# EAGLE design Board_v1_4 (EAGLE 9.6.2)
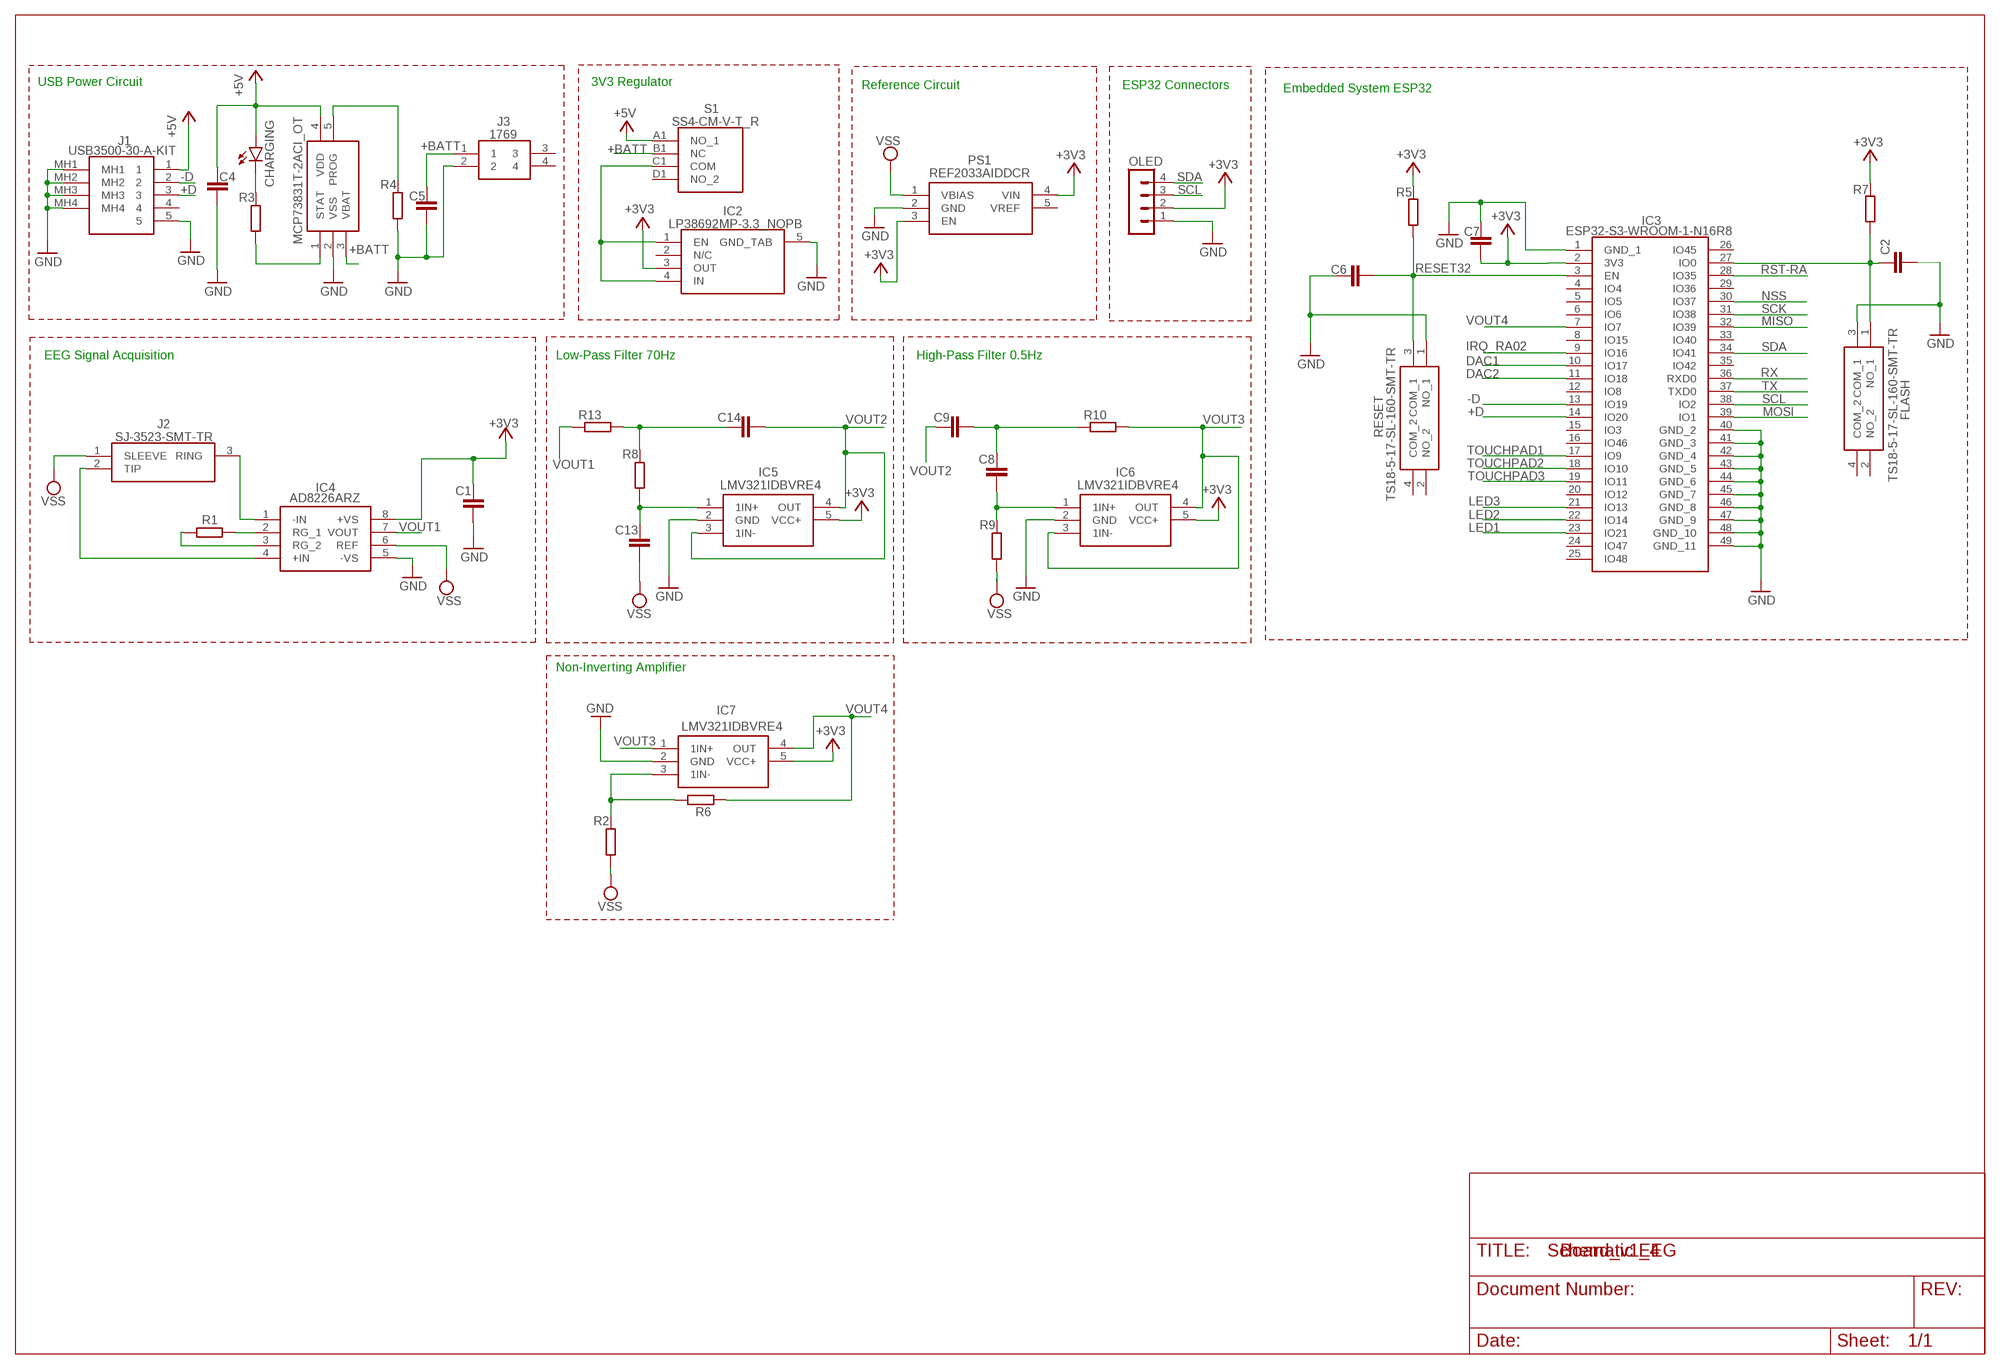
[diagram p0: schematic, sheet 1]

## Parts
C1  C-EUC0805  [C0805]
C2  C-EUC0805  [C0805]
C4  C-EUC0805  [C0805]
C5  C-EUC0805  [C0805]
C6  C-EUC0805  [C0805]
C7  C-EUC0805  [C0805]
C8  C-EUC0805  [C0805]
C9  C-EUC0805  [C0805]
C13  C-EUC0805  [C0805]
C14  C-EUC0805  [C0805]
CHARGING  LEDCHIP-LED0805  [CHIP-LED0805]
FLASH  TS18-5-17-SL-160-SMT-TR  [TS18517SL160SMTTR]
IC1  MCP73831T-2ACI_OT  [SOT95P270X145-5N]
IC2  LP38692MP-3.3_NOPB  [SOT150P700X180-5N]
IC3  ESP32-S3-WROOM-1-N16R8  [ESP32S3WROOM1N16R8]
IC4  AD8226ARZ  [SOIC127P600X175-8N]
IC5  LMV321IDBVRE4  [SOT95P280X145-5N]
IC6  LMV321IDBVRE4  [SOT95P280X145-5N]
IC7  LMV321IDBVRE4  [SOT95P280X145-5N]
J1  USB3500-30-A-KIT  [USB350030AKIT]
J2  SJ-3523-SMT-TR  [SJ3523SMTTR]
J3  1769  [1769]
OLED  MA04-1  [MA04-1]
PS1  REF2033AIDDCR  [SOT95P280X110-5N]
R1  R-EU_R0805  [R0805]
R2  R-EU_R0805  [R0805]
R3  220  R-EU_R0805  [R0805]
R4  R-EU_R0805  [R0805]
R5  R-EU_R0805  [R0805]
R6  R-EU_R0805  [R0805]
R7  R-EU_R0805  [R0805]
R8  R-EU_R0805  [R0805]
R9  R-EU_R0805  [R0805]
R10  R-EU_R0805  [R0805]
R13  R-EU_R0805  [R0805]
RESET  TS18-5-17-SL-160-SMT-TR  [TS18517SL160SMTTR]
S1  SS4-CM-V-T_R  [SS4CMVTR]

## Nets
+3V3: C1.1 C7.2 IC2.3(OUT) IC3.2(3V3) IC4.8(+VS) IC5.5(VCC+) IC6.5(VCC+) IC7.5(VCC+) OLED.2 PS1.3(EN) PS1.4(VIN) R5.2 R7.2
+5V: J1.1 S1.A1(NO_1)
+BATT: C5.2 IC1.3(VBAT) J3.1 S1.B1(NC)
+D: IC3.14(IO20) J1.3
-D: IC3.13(IO19) J1.2
DAC1: IC3.10(IO17)
DAC2: IC3.11(IO18)
GND: C1.2 C2.2 C4.1 C5.1 C6.1 C7.1 FLASH.3(COM_1) IC1.2(VSS) IC2.5(GND_TAB) IC3.1(GND_1) IC3.40(GND_2) IC3.41(GND_3) IC3.42(GND_4) IC3.43(GND_5) IC3.44(GND_6) IC3.45(GND_7) IC3.46(GND_8) IC3.47(GND_9) IC3.48(GND_10) IC3.49(GND_11) IC4.5(-VS) IC5.2(GND) IC6.2(GND) IC7.2(GND) J1.5 J1.MH1 J1.MH2 J1.MH3 J1.MH4 J3.2 OLED.1 PS1.2(GND) R4.1 RESET.1(NO_1)
IRQ_RA02: IC3.9(IO16)
LED1: IC3.23(IO21)
LED2: IC3.22(IO14)
LED3: IC3.21(IO13)
MISO: IC3.32(IO39)
MOSI: IC3.39(IO1)
N$1: IC4.2(RG_1) R1.2
N$2: IC4.3(RG_2) R1.1
N$3: IC4.1(-IN) J2.3(RING)
N$4: IC4.4(+IN) J2.2(TIP)
N$5: C8.2 IC6.1(1IN+) R9.2
N$6: IC1.1(STAT) R3.1
N$7: IC1.5(PROG) R4.2
N$8: CHARGING.C R3.2
N$9: C8.1 C9.2 R10.1
N$10: C2.1 FLASH.1(NO_1) IC3.27(IO0) R7.1
N$11: C13.1 IC5.1(1IN+) R8.1
N$13: IC2.1(EN) IC2.4(IN) S1.C1(COM)
N$14: IC7.3(1IN-) R2.2 R6.2
N$15: C4.2 CHARGING.A IC1.4(VDD)
N$17: C14.1 R8.2 R13.2
NSS: IC3.30(IO37)
RESET32: C6.2 IC3.3(EN) R5.1 RESET.3(COM_1)
RST-RA: IC3.28(IO35)
RX: IC3.36(RXD0)
SCK: IC3.31(IO38)
SCL: IC3.38(IO2) OLED.3
SDA: IC3.34(IO41) OLED.4
TOUCHPAD1: IC3.17(IO9)
TOUCHPAD2: IC3.18(IO10)
TOUCHPAD3: IC3.19(IO11)
TX: IC3.37(TXD0)
VOUT1: IC4.7(VOUT) R13.1
VOUT2: C9.1 C14.2 IC5.3(1IN-) IC5.4(OUT)
VOUT3: IC6.3(1IN-) IC6.4(OUT) IC7.1(1IN+) R10.2
VOUT4: IC3.7(IO7) IC7.4(OUT) R6.1
VSS: C13.2 IC4.6(REF) J2.1(SLEEVE) PS1.1(VBIAS) R2.1 R9.1
Unconnected: FLASH.2(NO_2) FLASH.4(COM_2) IC2.2(N/C) IC3.4(IO4) IC3.5(IO5) IC3.6(IO6) IC3.8(IO15) IC3.12(IO8) IC3.15(IO3) IC3.16(IO46) IC3.20(IO12) IC3.24(IO47) IC3.25(IO48) IC3.26(IO45) IC3.29(IO36) IC3.33(IO40) IC3.35(IO42) J1.4 J3.3 J3.4 PS1.5(VREF) RESET.2(NO_2) RESET.4(COM_2) S1.D1(NO_2)

## Notes on the sheet
- USB Power Circuit | 3V3 Regulator | Reference Circuit | ESP32 Connectors
- Embedded System ESP32
- EEG Signal Acquisition | Low-Pass Filter 70Hz | High-Pass Filter 0.5Hz
- Non-Inverting Amplifier
- Schematic EEG

## Library data of the parts
C1 C2 C4-C9 C13 C14 = rcl:C-EU: CAPACITOR, European symbol; SPICEPREFIX: C
CHARGING = led:LED: LED OSRAM: - CHIPLED LG R971, LG N971, LY N971, LG Q971, LY Q971, LO R971, LY R971 LH N974, LH R974 LS Q976, LO Q976, LY Q976 LO Q996 - Hyper CHIPLED LW Q18S LB Q993, LB Q99A, LB R99A - SideLED LS A670, LO A670, LY A670, LG A670, LP A670 LB A673, LV A673, LT A673, LW A673 LH A674 LY A675 LS A676, LA A676, LO A676, LY A676, LW A676 LS A679, LY A679, LG A679 - Hyper Micro SIDELED® LS Y876, LA Y876, LO Y876, LY Y876 LT Y87S - SmartLED LW L88C, LW L88S LB L89C, LB L89S, LG L890 LS L89K, LO L89K, LY L89K LS L896, LA L896, LO L896, LY L896 - TOPLED LS T670, LO T670, LY T670, LG T670, LP T670 LSG T670, LSP T670, LSY T670, LOP T670, LYG T670 LG T671, LOG T671, LSG T671 LB T673, LV T673, LT T673, LW T673 LH T674 LS T676, LA T676, LO T676, LY T676, LB T676, LH T676, LSB T676, LW T676 LB T67C, LV T67C, LT T67C, LS T67K, LO T67K, LY T67K, LW E67C LS E67B, LA E67B, LO E67B, LY E67B, LB E67C, LV E67C, LT E67C LW T67C LS T679, LY T679, LG T679 LS T770, LO T770, LY T770, LG T770, LP T770 LB T773, LV T773, LT T773, LW T773 LH T774 LS E675, LA E675, LY E675, LS T675 LS T776, LA T776, LO T776, LY T776, LB T776 LHGB T686 LT T68C, LB T68C - Hyper Mini TOPLED® LB M676 - Mini TOPLED Santana® LG M470 LS M47K, LO M47K, LY M47K Source: http://www.osram.convergy.de LUXEON: - LUMILED® LXK2-PW12-R00, LXK2-PW12-S00, LXK2-PW14-U00, LXK2-PW14-V00 LXK2-PM12-R00, LXK2-PM12-S00, LXK2-PM14-U00 LXK2-PE12-Q00, LXK2-PE12-R00, LXK2-PE12-S00, LXK2-PE14-T00, LXK2-PE14-U00 LXK2-PB12-K00, LXK2-PB12-L00, LXK2-PB12-M00, LXK2-PB14-N00, LXK2-PB14-P00, LXK2-PB14-Q00 LXK2-PR12-L00, LXK2-PR12-M00, LXK2-PR14-Q00, LXK2-PR14-R00 LXK2-PD12-Q00, LXK2-PD12-R00, LXK2-PD12-S00 LXK2-PH12-R00, LXK2-PH12-S00 LXK2-PL12-P00, LXK2-PL12-Q00, LXK2-PL12-R00 Source: www.luxeon.com KINGBRIGHT: KA-3528ASYC Source: www.kingbright.com
FLASH RESET = TS18-5-17-SL-160-SMT-TR:TS18-5-17-SL-160-SMT-TR: 5 x 5 mm, 1.7 mm Actuator Height, 160 gf, Silver, Surface Mount, TR, SPST, Tactile Switch Source: Datasheet <https://www.sameskydevices.com/product/resource/supplyframepdf/ts18.pdf>; DESCRIPTION: 5 x 5 mm, 1.7 mm Actuator Height, 160 gf, Silver, Surface Mount, TR, SPST, Tactile Switch; HEIGHT: 1.8mm; MANUFACTURER_NAME: Same Sky; MANUFACTURER_PART_NUMBER: TS18-5-17-SL-160-SMT-TR; MOUSER_PART_NUMBER: 179-TS18517SL160SMTT; MOUSER_PRICE-STOCK: https://www.mouser.co.uk/ProductDetail/CUI-Devices/TS18-5-17-SL-160-SMT-TR?qs=tlsG%2FOw5FFhWy38y3t272A%3D%3D
IC1 = MCP73831T-2ACI_OT:MCP73831T-2ACI_OT: Li-Ion Charge Controller 4.2V SOT23-5 Source: Datasheet <http://ww1.microchip.com/downloads/en/DeviceDoc/20001984g.pdf>; ARROW_PART_NUMBER: MCP73831T-2ACI/OT; ARROW_PRICE-STOCK: https://www.arrow.com/en/products/mcp73831t-2aciot/microchip-technology?utm_currency=USD&region=nac; DESCRIPTION: Li-Ion Charge Controller 4.2V SOT23-5; HEIGHT: 1.45mm; MANUFACTURER_NAME: Microchip; MANUFACTURER_PART_NUMBER: MCP73831T-2ACI/OT; MOUSER_PART_NUMBER: 579-MCP73831T-2ACIOT; MOUSER_PRICE-STOCK: https://www.mouser.co.uk/ProductDetail/Microchip-Technology/MCP73831T-2ACI-OT?qs=yUQqVecv4qvbBQBGbHx0Mw%3D%3D
IC2 = LP38692MP-3.3_NOPB:LP38692MP-3.3_NOPB: LP38692MP-3.3/NOPB, Low Dropout Voltage Regulator, 1A, 3.3 V +/-2.5%, 2.7 10 Vin, 5-Pin SOT-223 Source: Datasheet <http://www.ti.com/lit/ds/symlink/lp38692.pdf>; DESCRIPTION: LP38692MP-3.3/NOPB, Low Dropout Voltage Regulator, 1A, 3.3 V +/-2.5%, 2.7 10 Vin, 5-Pin SOT-223; HEIGHT: 1.8mm; MANUFACTURER_NAME: Texas Instruments; MANUFACTURER_PART_NUMBER: LP38692MP-3.3/NOPB; MOUSER_PART_NUMBER: 926-LP38692MP3.3NOPB; MOUSER_PRICE-STOCK: https://www.mouser.co.uk/ProductDetail/Texas-Instruments/LP38692MP-3.3-NOPB?qs=1FNqv8aZn1TpKuOP2NKBdg%3D%3D
IC3 = ESP32-S3-WROOM-1-N16R8:ESP32-S3-WROOM-1-N16R8: Multiprotocol Modules SMD Module, ESP32-S3R8, 3.3V, 8 MB Octal PSRAM Die, 16 MB Quad SPI Flash, PCB Antenna Source: Datasheet <https://www.espressif.com/sites/default/files/documentation/esp32-s3-wroom-1_wroom-1u_datasheet_en.pdf>; DESCRIPTION: Multiprotocol Modules SMD Module, ESP32-S3R8, 3.3V, 8 MB Octal PSRAM Die, 16 MB Quad SPI Flash, PCB Antenna; HEIGHT: 3.25mm; MANUFACTURER_NAME: Espressif Systems; MANUFACTURER_PART_NUMBER: ESP32-S3-WROOM-1-N16R8; MOUSER_PART_NUMBER: 356-ESP32S3WRM1N16R8; MOUSER_PRICE-STOCK: https://www.mouser.co.uk/ProductDetail/Espressif-Systems/ESP32-S3-WROOM-1-N16R8?qs=Li%252BoUPsLEnvQc9gW6AMhZg%3D%3D
IC4 = AD8226ARZ:AD8226ARZ: Wide Supply Range, Rail-to-Rail Output Instrumentation Amplifier Source: Datasheet <http://componentsearchengine.com/Datasheets/3/AD8226ARZ.pdf>; DESCRIPTION: Wide Supply Range, Rail-to-Rail Output Instrumentation Amplifier; HEIGHT: 1.75mm; MANUFACTURER_NAME: Analog Devices; MANUFACTURER_PART_NUMBER: AD8226ARZ; MOUSER_PART_NUMBER: 584-AD8226ARZ; MOUSER_PRICE-STOCK: https://www.mouser.co.uk/ProductDetail/Analog-Devices/AD8226ARZ?qs=%2FtpEQrCGXCzihJADRPlhCg%3D%3D
IC5-IC7 = LMV321IDBVRE4:LMV321IDBVRE4: OP Amp Single GP R-R O/P 5.5V 5-Pin SOT-23 T/R Source: Datasheet <https://www.ti.com/lit/ds/symlink/lmv321.pdf?ts=1639294341048&ref_url=https%3A%2F%2Fwww.ti.com%2Fstore%2Fti%2Fen%2Fp%2Fproduct%2F%3Fp%3DLMV321IDBVR>; DESCRIPTION: OP Amp Single GP R-R O/P 5.5V 5-Pin SOT-23 T/R; HEIGHT: 1.45mm; MANUFACTURER_NAME: Texas Instruments; MANUFACTURER_PART_NUMBER: LMV321IDBVRE4; MOUSER_PART_NUMBER: 595-LMV321IDBVRE4; MOUSER_PRICE-STOCK: https://www.mouser.co.uk/ProductDetail/Texas-Instruments/LMV321IDBVRE4?qs=yhNIDeTE%252BcaI6cu5FHph6A%3D%3D
J1 = USB3500-30-A-KIT:USB3500-30-A-KIT: USB Connectors Micro B Skt, Mid Mount-SMT, R/A, 30u", With Peg, T&R, IP67 + USBTJ-02 Gasket Source: Datasheet <https://gct.co/files/drawings/usb3500.pdf>; DESCRIPTION: USB Connectors Micro B Skt, Mid Mount-SMT, R/A, 30u", With Peg, T&R, IP67 + USBTJ-02 Gasket; HEIGHT: 2.8mm; MANUFACTURER_NAME: GCT (GLOBAL CONNECTOR TECHNOLOGY); MANUFACTURER_PART_NUMBER: USB3500-30-A-KIT; MOUSER_PART_NUMBER: 640-USB3500-30-A-KIT; MOUSER_PRICE-STOCK: https://www.mouser.co.uk/ProductDetail/GCT/USB3500-30-A-KIT?qs=KUoIvG%2F9IlZmD2kH2DfgYg%3D%3D
J2 = SJ-3523-SMT-TR:SJ-3523-SMT-TR: 3.5 mm, Stereo, Right Angle, Surface Mount (SMT), 3 Conductors, 0 Internal Switches, Audio Jack Connector Source: Datasheet <https://www.sameskydevices.com/product/resource/supplyframepdf/sj-352x-smt.pdf>; DESCRIPTION: 3.5 mm, Stereo, Right Angle, Surface Mount (SMT), 3 Conductors, 0 Internal Switches, Audio Jack Connector; HEIGHT: 5.2mm; MANUFACTURER_NAME: Same Sky; MANUFACTURER_PART_NUMBER: SJ-3523-SMT-TR; MOUSER_PART_NUMBER: 490-SJ-3523-SMT-TR; MOUSER_PRICE-STOCK: https://www.mouser.co.uk/ProductDetail/CUI-Devices/SJ-3523-SMT-TR?qs=WyjlAZoYn51zOHzJ3r4ZRA%3D%3D
J3 = 1769:1769: Adafruit Accessories JST-PH 2-pin SMT Right Angle Connect Source: Datasheet <https://cdn-shop.adafruit.com/datasheets/17311.pdf>; ARROW_PART_NUMBER: 1769; ARROW_PRICE-STOCK: https://www.arrow.com/en/products/1769/adafruit-industries?utm_currency=USD&region=nac; DESCRIPTION: Adafruit Accessories JST-PH 2-pin SMT Right Angle Connect; HEIGHT: 5.5mm; MANUFACTURER_NAME: Adafruit; MANUFACTURER_PART_NUMBER: 1769; MOUSER_PART_NUMBER: 485-1769; MOUSER_PRICE-STOCK: https://www.mouser.co.uk/ProductDetail/Adafruit/1769?qs=GURawfaeGuBbgoGtf2XstA%3D%3D
OLED = con-lstb:MA04-1: PIN HEADER; OC_FARNELL: unknown; OC_NEWARK: unknown
PS1 = REF2033AIDDCR:REF2033AIDDCR: Low-Drift, Low-Power, Dual-Output Vref and Vref/2 Voltage Reference Source: Datasheet <http://www.ti.com/lit/ds/symlink/ref2033.pdf>; DESCRIPTION: Low-Drift, Low-Power, Dual-Output Vref and Vref/2 Voltage Reference; HEIGHT: 1.1mm; MANUFACTURER_NAME: Texas Instruments; MANUFACTURER_PART_NUMBER: REF2033AIDDCR; MOUSER_PART_NUMBER: 595-REF2033AIDDCR; MOUSER_PRICE-STOCK: https://www.mouser.co.uk/ProductDetail/Texas-Instruments/REF2033AIDDCR?qs=7z%252BmIopC6%2FKHHOBVNaL7UQ%3D%3D
R1-R10 R13 = rcl:R-EU_: RESISTOR, European symbol; SPICEPREFIX: R
S1 = SS4-CM-V-T_R:SS4-CM-V-T_R: Slide Switches Slide Type 1P3T (2.0mm height) Source: Datasheet <https://componentsearchengine.com/Datasheets/1/SS4-CM-V-T_R.pdf>; DESCRIPTION: Slide Switches Slide Type 1P3T (2.0mm height); HEIGHT: 2mm; MANUFACTURER_NAME: Diptronics; MANUFACTURER_PART_NUMBER: SS4-CM-V-T/R; MOUSER_PART_NUMBER: 113-SS4CMVTR; MOUSER_PRICE-STOCK: https://www.mouser.co.uk/ProductDetail/Diptronics/SS4-CM-V-T-R?qs=MLItCLRbWswqNEU%2F6grMKg%3D%3D

## Board
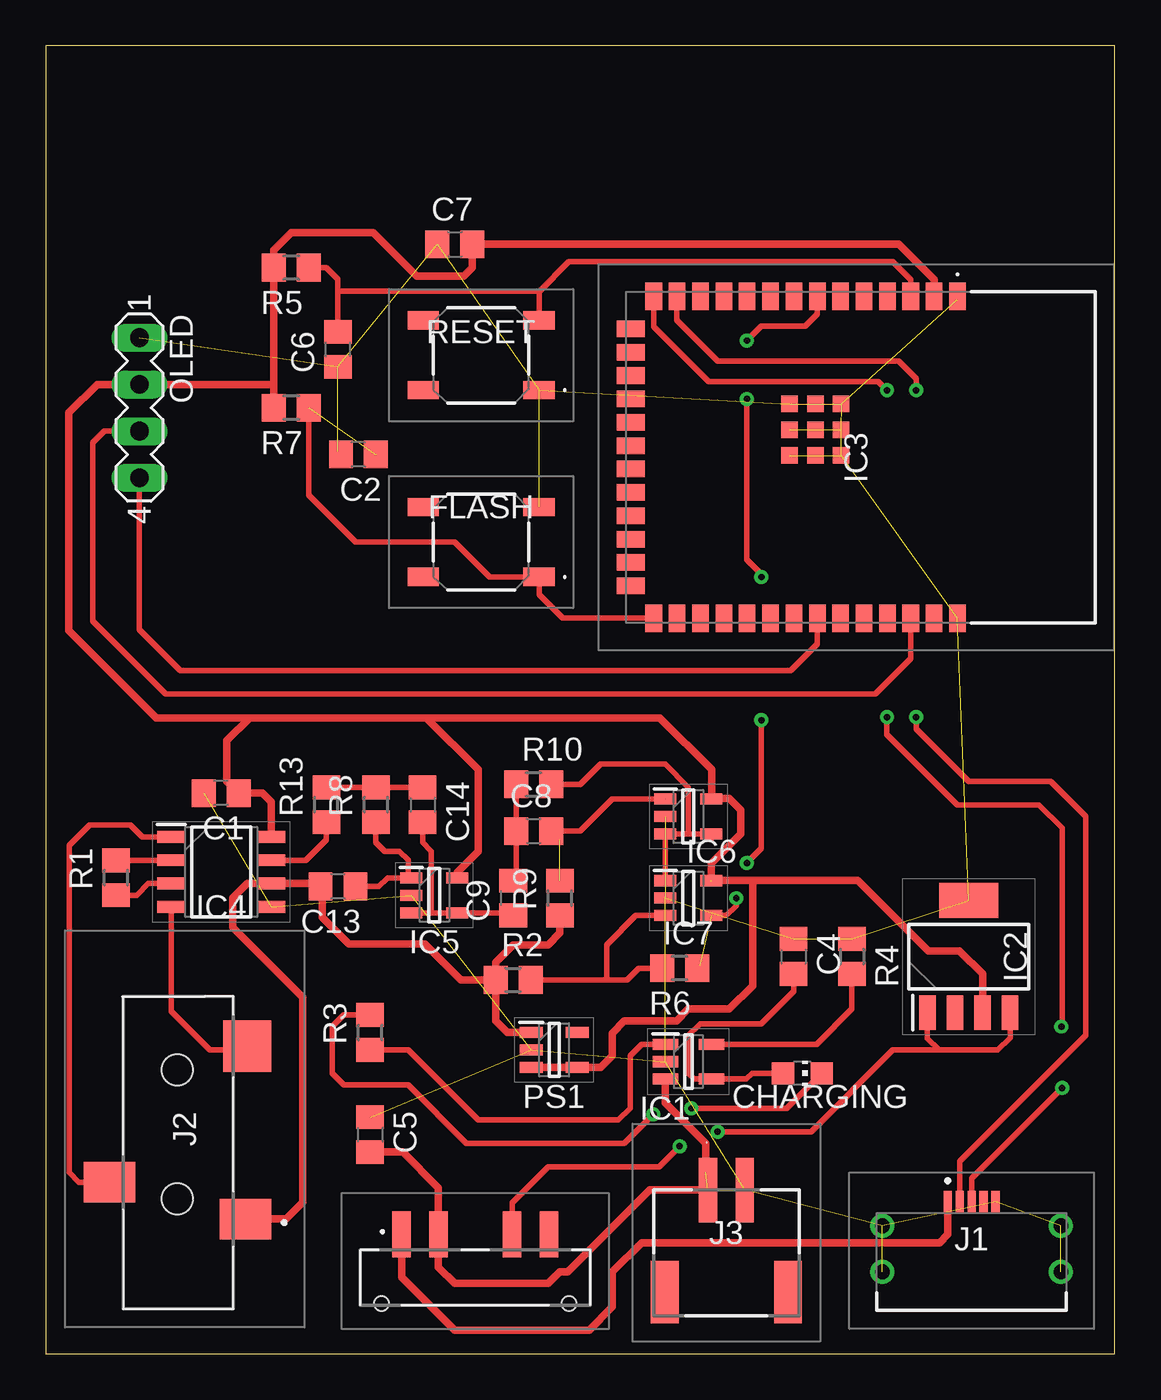
[diagram p1: board, top side]
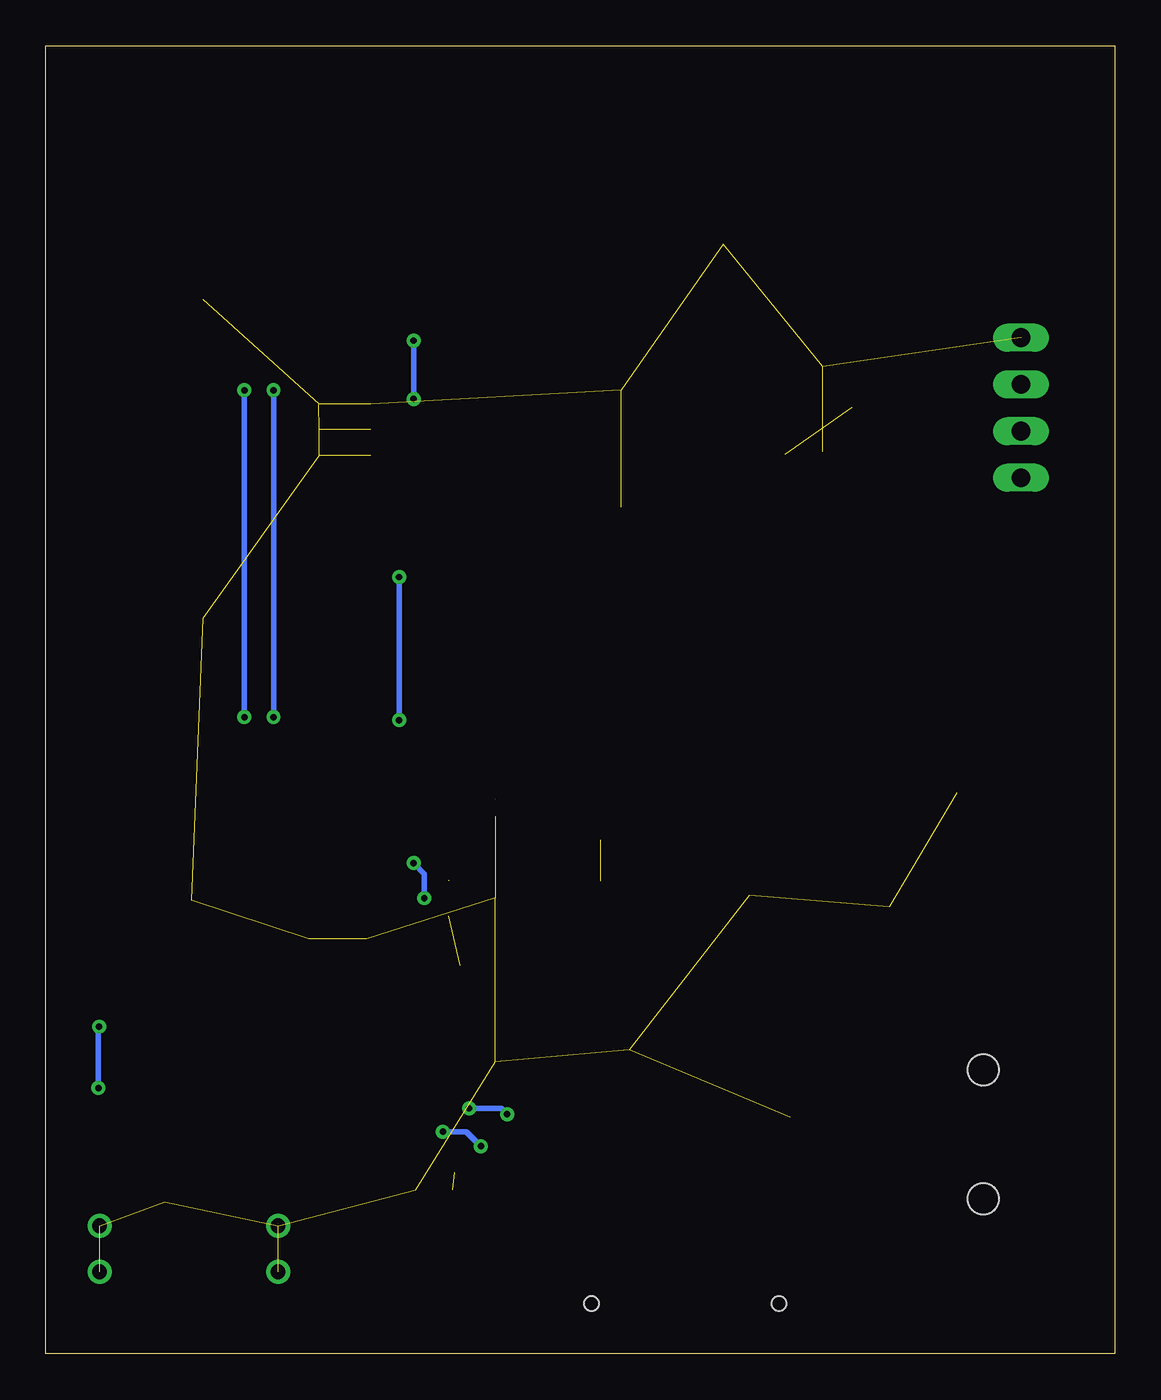
[diagram p2: board, bottom side, seen from below]

Size 58.09 x 71.11 mm. Coordinates in mm from the lower left corner, seen from the top.
Outline: 0,0 58.09,0 58.09,71.11 0,71.11 0,0
Copper layers (1*16): Top 0.035mm / dielectric 1.5mm / Bottom 0.035mm
Design rules "default": minimum track width 6mil, minimum drill 0.35mm, track to track 6mil, track to pad 6mil, pad to pad 6mil, via to via 6mil, smd to smd 6mil, copper to edge 40mil, drill to drill 6mil, minimum pad ring 10mil, minimum via ring 8mil, stop-mask expansion 4mil, vias tented up to drill 0mil, thermal gap 10mil

### Footprints (pad centres in the part's own frame; a part is rotated, then mirrored left to right if it is on the bottom)
C0805 = smd 1.3 x 1.5: 1 -0.95,0; 2 0.95,0
CHIP-LED0805 = smd 1.2 x 1.2: A 0,-1.05; C 0,1.05
TS18517SL160SMTTR = smd 1.7 x 1: 1 -3.15,1.9; 2 3.15,1.9; 3 -3.15,-1.9; 4 3.15,-1.9
SOT95P270X145-5N = smd 1.4 x 0.6: 1 -1.25,0.95; 2 -1.25,0; 3 -1.25,-0.95; 4 1.25,-0.95; 5 1.25,0.95
SOT150P700X180-5N = smd 1.9 x 0.9: 1 -3.05,2.25; 2 -3.05,0.75; 3 -3.05,-0.75; 4 -3.05,-2.25 | smd 1.9 x 3.2: 5 3.05,0
ESP32S3WROOM1N16R8 = smd 1.5 x 0.9: 1 -8.75,5.26; 2 -8.75,3.99; 3 -8.75,2.72; 4 -8.75,1.45; 5 -8.75,0.18; 6 -8.75,-1.09; 7 -8.75,-2.36; 8 -8.75,-3.63; 9 -8.75,-4.9; 10 -8.75,-6.17; 11 -8.75,-7.44; 12 -8.75,-8.71; 13 -8.75,-9.98; 14 -8.75,-11.25; 27 8.75,-11.25; 28 8.75,-9.98; 29 8.75,-8.71; 30 8.75,-7.44; 31 8.75,-6.17; 32 8.75,-4.9; 33 8.75,-3.63; 34 8.75,-2.36; 35 8.75,-1.09; 36 8.75,0.18; 37 8.75,1.45; 38 8.75,2.72; 39 8.75,3.99; 40 8.75,5.26 | smd 0.9 x 1.5: 15 -6.985,-12.5; 16 -5.715,-12.5; 17 -4.445,-12.5; 18 -3.175,-12.5; 19 -1.905,-12.5; 20 -0.635,-12.5; 21 0.635,-12.5; 22 1.905,-12.5; 23 3.175,-12.5; 24 4.445,-12.5; 25 5.715,-12.5; 26 6.985,-12.5 | smd 0.9 x 0.9: 41 -1.5,-2.46; 42 -2.9,-1.06; 43 -2.9,-2.46; 44 -2.9,-3.86; 45 -1.5,-3.86; 46 -0.1,-3.86; 47 -0.1,-2.46; 48 -0.1,-1.06; 49 -1.5,-1.06
SOIC127P600X175-8N = smd 1.525 x 0.65: 1 -2.712,1.905; 2 -2.712,0.635; 3 -2.712,-0.635; 4 -2.712,-1.905; 5 2.712,-1.905; 6 2.712,-0.635; 7 2.712,0.635; 8 2.712,1.905
SOT95P280X145-5N = smd 1.2 x 0.6: 1 -1.25,0.95; 2 -1.25,0; 3 -1.25,-0.95; 4 1.25,-0.95; 5 1.25,0.95
USB350030AKIT = smd 0.45 x 1.2: 1 -1.3,3.8; 2 -0.65,3.8; 3 0,3.8; 4 0.65,3.8; 5 1.3,3.8 | drill 0.8 pad 1.2: MH1 -4.85,2.5; MH2 4.85,2.5; MH3 -4.85,0; MH4 4.85,0
SJ3523SMTTR = smd 2.2 x 2.8: 1 2.4,-3.7; 3 4.4,3.7 | smd 2.8 x 2.6: 2 11.8,-3.8 | hole 1.7: 3.5,0; 10.5,0
1769 = smd 1 x 3.5: 1 -1,0; 2 1,0 | smd 1.5 x 3.4: 3 -3.35,-5.55; 4 3.35,-5.55
MA04-1 = drill 1.016 long: 1 -3.81,0; 2 -1.27,0; 3 1.27,0; 4 3.81,0
SOT95P280X110-5N = smd 1.25 x 0.6: 1 -1.25,0.95; 2 -1.25,0; 3 -1.25,-0.95; 4 1.25,-0.95; 5 1.25,0.95
R0805 = smd 1.3 x 1.5: 1 -0.95,0; 2 0.95,0
SS4CMVTR = smd 1 x 2.5: A1 -4,2.35; B1 -2,2.35; C1 2,2.35; D1 4,2.35 | hole 0.8: -5.1,-1.4; 5.1,-1.4

### Placement (x,y rotation side)
C1  9.53,30.48 180 top
C2  16.99,48.89 180 top
C4  40.64,21.59 270 top
C5  17.62,11.91 270 top
C6  15.88,54.61 90 top
C7  22.23,60.32 0 top
C8  26.51,28.42 0 top
C9  25.4,24.77 90 top
C13  15.88,25.4 180 top
C14  20.48,29.85 270 top
CHARGING  41.12,15.24 270 top
FLASH  23.65,44.13 180 top
IC1  34.92,15.88 0 top
IC2  50.16,21.59 90 top
IC3  44.29,48.74 270 top
IC4  9.53,26.19 0 top
IC5  21.11,24.92 0 top
IC6  34.92,29.21 0 top
IC7  34.92,24.77 0 top
J1  50.32,4.45 0 top
J2  7.14,4.92 90 top
J3  36.99,8.89 0 top
OLED  5.08,51.43 270 top
PS1  27.62,16.51 0 top
R1  3.81,25.88 90 top
R2  25.4,20.32 0 top
R3  17.62,17.46 90 top
R4  43.81,21.59 270 top
R5  13.34,59.05 180 top
R6  34.45,20.96 180 top
R7  13.34,51.43 180 top
R8  17.94,29.85 90 top
R9  27.94,24.77 90 top
R10  26.51,30.96 0 top
R13  15.24,29.85 90 top
RESET  23.65,54.29 180 top
S1  23.34,4.13 0 top

### Tracks (layer width: path | path; a pad name or v marks a point on that pad's centre or on a via)
+3V3  (1 unrouted)
  Top 0.305: IC4.8 12.24,28.11
  Top 0.406: 50.8,18.66 IC2.3 50.91,20.64 49.65,21.91 47.95,21.91 46.68,23.18 | 36.2,30.14 IC6.5 36.2,30.18 | 20.68,34.57 33.38,34.57 36.2,31.75 36.2,30.18 | IC7.5 36.2,25.74 | 36.2,30.18 37.13,30.18 37.15,30.2 37.78,29.56 37.78,28.26 36.17,26.65 IC7.5 | 38.42,25.72 38.42,20 37.15,18.73 34.92,18.73 34.29,18.1 32.38,18.1 31.43,18.1 30.8,17.41 30.8,16.19 30.16,15.56 29.21,15.56 29.2,15.55 29.19,15.56 PS1.4 PS1.3 | 12.38,52.7 OLED.2 2.77,52.7 1.24,51.17 1.24,39.32 5.99,34.57 11.07,34.57 | IC3.2 48.28,58.4 46.35,60.32 C7.2 23.18,59.05 22.7,58.58 20.16,58.58 17.78,60.96 13.34,60.96 12.38,60.01 R5.2 12.38,52.71 12.38,52.7 | 12.23,51.28 R7.2 12.38,52.7 | IC5.5 22.36,26.17 23.5,27.31 23.5,31.75 20.68,34.57 | 46.68,23.18 46.67,23.18 | 35.88,25.72 36.2,25.72 | IC7.5 36.2,25.7 36.22,25.72 38.42,25.72 | IC4.8 12.24,29.99 11.75,30.48 C1.1 9.84,31.12 9.84,33.34 11.07,34.57 | 20.68,34.57 11.07,34.57 | 46.68,23.18 44.14,25.72 38.42,25.72
+5V
  Top 0.406: S1.A1 19.34,4.16 22.23,1.27 29.53,1.27 30.8,2.54 30.8,4.45 32.38,6.03 48.58,6.03 49.02,6.48 J1.1
+BATT  (1 unrouted)
  Top 0.305: 21.5,6.67 21.34,6.83 | 21.27,6.41 S1.B1
  Top 0.406: S1.B1 21.34,6.83 | S1.B1 21.34,9.02 19.4,10.96 C5.2 | IC1.3 33.67,13.63 35.88,11.43 35.88,9.84 | S1.B1 21.34,4.7 22.23,3.81 27.3,3.81 27.94,4.45 28.37,4.45 32.81,8.89 J3.1
+D  (via drill 0.35)
  Top 0.305: IC3.14 33.04,55.86 36.04,52.86 45.24,52.86 v45.72,52.39 | v55.2,17.78 55.24,17.83 55.24,28.58 53.98,29.85 49.53,29.85 45.72,33.66 v45.72,34.61 | J1.3 50.32,9.53 v55.24,14.45
  Bottom 0.305: v55.24,14.45 55.24,17.73 v55.2,17.78 | v45.72,52.39 v45.72,34.61
-D  (via drill 0.35)
  Top 0.305: IC3.13 34.29,57.46 34.29,56.2 36.51,53.98 46.35,53.98 47.31,53.02 v47.31,52.39 | J1.2 49.67,10.46 56.52,17.3 56.52,29.21 54.61,31.12 50.16,31.12 47.31,33.97 v47.31,34.61
  Bottom 0.305: v47.31,52.39 v47.31,34.61
GND  (33 unrouted)
  Top 0.305: IC3.1 49.55,57.31 | 43.27,51.59 IC3.42
  Top 0.406: RESET.1 | 15.88,49.06 C2.2
N$1
  Top 0.305: IC4.2 R1.2
N$2
  Top 0.305: R1.1 4.92,24.93 5.56,25.56 IC4.3
N$3
  Top 0.305: IC4.1 5.23,28.1 4.59,28.73 2.38,28.73 1.27,27.62 1.27,9.84 1.79,9.32 J2.3
N$4
  Top 0.305: IC4.4 6.81,18.61 8.9,16.52 10.74,16.52 J2.2
N$5  (2 unrouted)
  Top 0.305: 27.94,27.94 C8.2 29.05,28.42 30.8,30.16 IC6.1 | 33.66,30.17 33.66,30.18
N$6
  Top 0.305: R3.1 19.68,16.51 23.5,12.7 31.11,12.7 31.75,13.33 31.75,16.18 32.4,16.83 IC1.1
N$7
  Top 0.305: IC1.5 41.91,16.83 43.81,18.73 R4.2
N$8  (via drill 0.35)
  Top 0.305: v33.02,13.02 31.43,11.43 22.86,11.43 19.68,14.61 16.19,14.61 15.56,15.24 15.56,17.78 16.19,18.41 R3.2 | CHARGING.C 40.26,13.33 v35.08,13.33
  Bottom 0.305: v33.02,13.02 33.34,13.33 v35.08,13.33
N$9
  Top 0.305: 25.56,25.88 C9.2 25.56,25.87 C8.1 R10.1
N$10  (1 unrouted)
  Top 0.305: IC3.27 28.1,39.99 26.8,41.28 FLASH.1 24.12,42.23 22.23,44.13 16.83,44.13 14.29,46.67 R7.1
N$11
  Top 0.305: IC5.1 19.68,25.87 | R8.1 17.94,27.78 18.41,27.31 19.21,27.31 19.68,26.83 19.68,25.87 | C13.1 18.09,25.4 18.57,25.88 19.68,25.88 19.68,25.87
N$13  (via drill 0.35)
  Top 0.305: IC2.1 47.91,17.15 48.55,16.51 | S1.C1 25.34,8.19 27.3,10.16 33.34,10.16 v34.45,11.27 | v36.51,12.06 41.59,12.06 46.04,16.51 48.55,16.51 | 48.55,16.51 51.75,16.51 52.41,17.17 IC2.4
  Bottom 0.305: v34.45,11.27 35.24,12.06 v36.51,12.06
N$14
  Top 0.305: IC7.3 32.07,23.82 30.48,22.23 30.48,20.32 | R2.2 30.48,20.32 | 30.48,20.32 31.59,20.32 32.23,20.96 R6.2
N$15
  Top 0.305: CHARGING.A 38.4,15.24 38.08,14.92 IC1.4 35.24,14.92 34.92,15.24 34.92,17.3 35.56,17.94 38.89,17.94 40.64,19.69 C4.2
N$17
  Top 0.305: R13.2 15.87,30.8 15.88,30.8 R8.2 18.57,30.8 20,30.8 C14.1
RESET32
  Top 0.305: 15.88,57.78 26.8,57.78 RESET.3 26.8,57.76 28.42,59.37 46.04,59.37 47.01,58.4 IC3.3 | R5.1 15.24,59.05 15.88,58.42 15.88,57.78 | 15.88,57.78 C6.2
  Top 0.406: R5.1 13.97,59.37
SCL
  Top 0.305: OLED.3 3.17,50.16 2.54,49.53 2.54,39.85 6.51,35.88 45.09,35.88 47.01,37.8 IC3.38
SDA
  Top 0.305: IC3.34 41.93,38.6 40.48,37.15 7.3,37.15 5.08,39.37 OLED.4
VOUT1
  Top 0.305: IC4.7 14.13,26.83 15.24,27.94 R13.1
VOUT2
  Top 0.305: IC5.4 25.24,23.97 C9.1 | IC5.4 20.95,23.97 20.95,27.31 20.48,27.78 C14.2 | IC5.3 IC5.4
  Top 0.406: C14.2 20.64,28.74
VOUT3
  Top 0.305: R10.2 29.05,30.96 30.16,32.07 33.66,32.07 34.92,30.8 34.92,28.26 IC6.4 IC6.3 33.66,28.24 33.66,25.74 IC7.1
  Top 0.406: 36.17,28.08 IC6.4
VOUT4  (via drill 0.35)  (1 unrouted)
  Top 0.203: R6.1 35.56,21.11 | 42.07,57.35 IC3.7
  Top 0.305: v38.89,34.45 38.89,27.46 v38.1,26.67 | v38.89,42.23 38.97,42.31 38.1,43.18 v38.1,51.91 | v38.1,55.09 38.89,55.88 41.27,55.88 41.93,56.54 IC3.7 | IC7.4 36.99,23.82 37.52,24.35 v37.52,24.77
  Top 0.406: R6.1 35.38,20.97 | 36.19,23.8 IC7.4
  Bottom 0.305: v38.1,26.67 37.52,26.1 v37.52,24.77 | v38.89,34.45 v38.89,42.23 | v38.1,51.91 v38.1,55.09
VSS
  Top 0.305: IC4.6 12.24,25.39
  Top 0.406: R9.1 27.94,22.86 27.3,22.23 25.4,22.23 24.45,21.28 R2.1 | PS1.1 25.09,17.46 24.45,18.1 R2.1 | J2.1 13.07,7.32 13.97,8.22 13.97,19.37 10.16,23.18 10.16,24.77 10.95,25.56 IC4.6 14.77,25.56 C13.2 15.03,25.3 15.03,23.71 16.46,22.28 20.58,22.28 22.54,20.32 R2.1